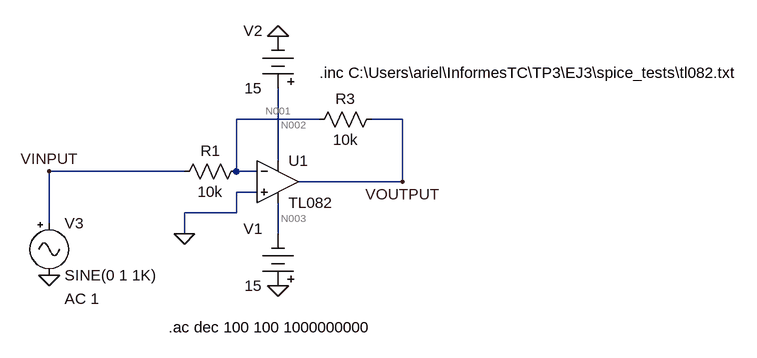
[diagram p0: schematic test01.asc]
test01.asc, the LTspice schematic file:
Version 4
SHEET 1 1248 680
WIRE 576 256 448 256
WIRE 704 256 656 256
WIRE 512 320 512 208
WIRE 368 336 160 336
WIRE 448 336 448 256
WIRE 480 336 448 336
WIRE 704 352 704 256
WIRE 704 352 544 352
WIRE 480 368 448 368
WIRE 448 400 448 368
WIRE 448 400 368 400
WIRE 160 416 160 336
WIRE 368 432 368 400
WIRE 512 432 512 384
FLAG 512 512 0
FLAG 512 128 0
FLAG 368 432 0
FLAG 160 496 0
FLAG 704 352 VOUTPUT
FLAG 160 336 VINPUT
SYMBOL Opamps\\opamp2 512 288 R0
SYMATTR InstName U1
SYMATTR Value TL082
SYMATTR SpiceModel TL082
SYMBOL res 672 240 R90
WINDOW 0 0 56 VBottom 2
WINDOW 3 32 56 VTop 2
SYMATTR InstName R3
SYMATTR Value 10k
SYMBOL Misc\\battery 512 528 R180
WINDOW 0 24 104 Left 2
WINDOW 3 24 16 Left 2
WINDOW 123 0 0 Left 2
WINDOW 39 0 0 Left 2
SYMATTR InstName V1
SYMATTR Value 15
SYMBOL Misc\\battery 512 224 R180
WINDOW 0 24 104 Left 2
WINDOW 3 24 16 Left 2
WINDOW 123 0 0 Left 2
WINDOW 39 0 0 Left 2
SYMATTR InstName V2
SYMATTR Value 15
SYMBOL Misc\\signal 160 400 R0
WINDOW 123 24 132 Left 2
WINDOW 39 0 0 Left 2
SYMATTR InstName V3
SYMATTR Value2 AC 1
SYMBOL res 464 320 R90
WINDOW 0 0 56 VBottom 2
WINDOW 3 32 56 VTop 2
SYMATTR InstName R1
SYMATTR Value 10k
TEXT 576 184 Left 2 !.inc C:\\Users\\ariel\\InformesTC\\TP3\\EJ3\\spice_tests\\tl082.txt
TEXT 344 576 Left 2 !.ac dec 100 100 1000000000

The netlist it stands for:
* test01.asc
XU1 0 N001 N002 N003 VOUTPUT TL082 TL082  ; pins In+ In- V+ V- OUT
R3 VOUTPUT N001 10k
V1 0 N003 15
V2 N002 0 15
V3 VINPUT 0 SINE(0 1 1K) AC 1
R1 N001 VINPUT 10k
.inc C:\Users\ariel\InformesTC\TP3\EJ3\spice_tests\tl082.txt
.ac dec 100 100 1000000000
.backanno
.end

* Results of the author's LTspice run, read from the files saved beside the schematic
* Operating Point, zero values left out:
*   V(n001) = 5 mV
*   V(n002) = 15 V
*   V(n003) = -15 V
*   V(voutput) = 10 mV
*   I(R1) = 500 nA
*   I(R3) = 500.1 nA
*   I(V3) = 500 nA
*   I(V2) = -2.101 mA
*   I(V1) = -2.1 mA
*   Ix(u1:1) = 39 pA
*   Ix(u1:2) = 89.01 pA
*   Ix(u1:99) = 2.1 mA
*   Ix(u1:50) = -2.1 mA
*   Ix(u1:28) = -500.1 nA
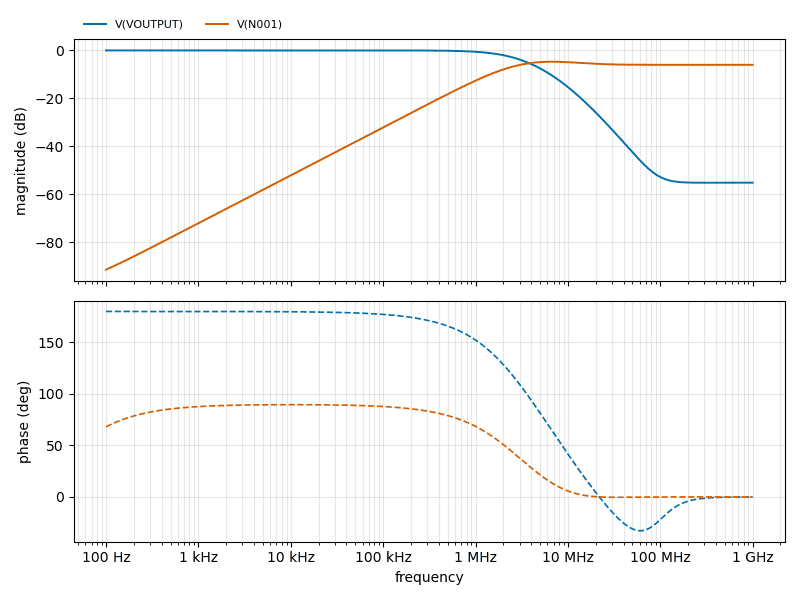
[diagram p1: AC Analysis of test01.asc, plotted from the saved traces]
* AC Analysis, 1 run:
*   V(VOUTPUT): -0.00 dB at 100 Hz, -55.16 dB at 1 GHz, peak -0.00 dB at 100 Hz, 3 dB below the peak at 2.569 MHz
*   V(N001): -91.42 dB at 100 Hz, -6.01 dB at 1 GHz, peak -4.72 dB at 6.761 MHz, 3 dB below the peak at 2.076 MHz